# Altium schematic sheet UART&SBUS&JTAG.SchDoc
size A4
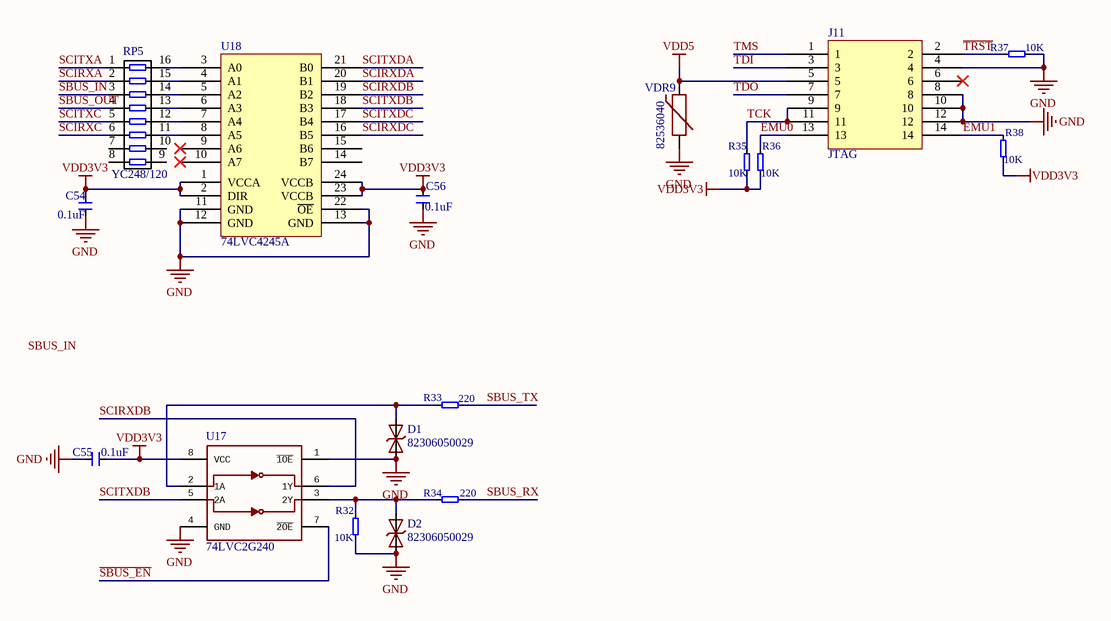
[diagram p0: UART&SBUS&JTAG.SchDoc]

## Parts
C54  0.1uF  [0603C]
C55  0.1uF  [0603C]
C56  0.1uF  [0603C]
D1  82306050029  [0603R]
D2  82306050029  [0603R]
J11  JTAG  [IDC14]
R32  10K  [0603R]
R33  220  [0603R]
R34  220  [0603R]
R35  10K  [0603R]
R36  10K  [0603R]
R37  10K  [0603R]
R38  10K  [0603R]
RP5  YC248/120  [YC248]
U17  74LVC2G240  [VSSOP-8]
U18  74LVC4245A  [SSOP24]
VDR9  82536040  [0603R]

## Nets
GND: C54.1 C55.2 C56.1 D1.2 D2.2 J11.4 J11.8 J11.10 J11.12 R32.2 R37.1 U17.1(~{1OE}) U17.4(GND) U18.11(GND) U18.12(GND) U18.13(GND) U18.22(~{OE}) VDR9.1
VDD3V3: C54.2 C55.1 C56.2 R35.1 R36.1 R38.1 U17.8(VCC) U18.1(VCCA) U18.2(DIR) U18.23(VCCB) U18.24(VCCB)
VDD5: J11.5 VDR9.2
EMU0: J11.13 R36.2
EMU1: J11.14 R38.2
~{SBUS_EN}: U17.7(~{2OE})
SBUS_IN: RP5.3
SBUS_OUT: RP5.4
SBUS_RX: R34.1
SBUS_TX: R33.1
SCIRXA: RP5.2
SCIRXC: RP5.6
SCIRXDA: U18.20(B1)
SCIRXDB: U17.6(1Y) U18.19(B2)
SCIRXDC: U18.16(B5)
SCITXA: RP5.1
SCITXC: RP5.5
SCITXDA: U18.21(B0)
SCITXDB: U17.5(2A) U18.18(B3)
SCITXDC: U18.17(B4)
~{TRST}: J11.2 R37.2
TCK: J11.9 J11.11 R35.2
TDI: J11.3
TD~{O}: J11.7
TMS: J11.1
NetD1_1: D1.1 R33.2 U17.2(1A)
NetD2_1: D2.1 R32.1 R34.2 U17.3(2Y)
NetRP5_11: RP5.11 U18.8(A5)
NetRP5_12: RP5.12 U18.7(A4)
NetRP5_13: RP5.13 U18.6(A3)
NetRP5_14: RP5.14 U18.5(A2)
NetRP5_15: RP5.15 U18.4(A1)
NetRP5_16: RP5.16 U18.3(A0)

Not connected (* = marked no-connect by the designer): J11 6*; RP5 7 8 9 10; U18 9(A6)* 10(A7)* 14(B7) 15(B6)

## Notes on the sheet
- Labels drawn without touching a wire or pin: SBUS_IN

## Library data of the parts
C54-C56 = C
D1 D2 = DIODE-TVS/Bidirectional
J11 = IDC-14
R32-R38 = R
RP5 = RP
VDR9 = Varistor